# Altium schematic sheet Sheet1.SchDoc: =GlobalProjectName
size 410 x 297 mm; ApprovedBy: Утвердил; CheckedBy: Проверил; Author: Разработал; SheetNumber: Лист; SheetTotal: Листов; PageSetup: Record=PageOptions|CenterHorizontal=True|CenterVertical=True|PrintScale=1.00|XCorrection=1.00|YCorrection=1.00|PrintKind=1|BorderSize=5000000|LeftOffset=0|BottomOffset=0|Orientation=2|PaperLength=1000|PaperWidth=1000|Scale=100|PaperSource=15|PrintQuality=1200|MediaType=1|DitherType=10|PaperKind=A3|PrintScaleMode=1; Weight: -; ScaleFactor: -; NormInspection: Норм.Контр.
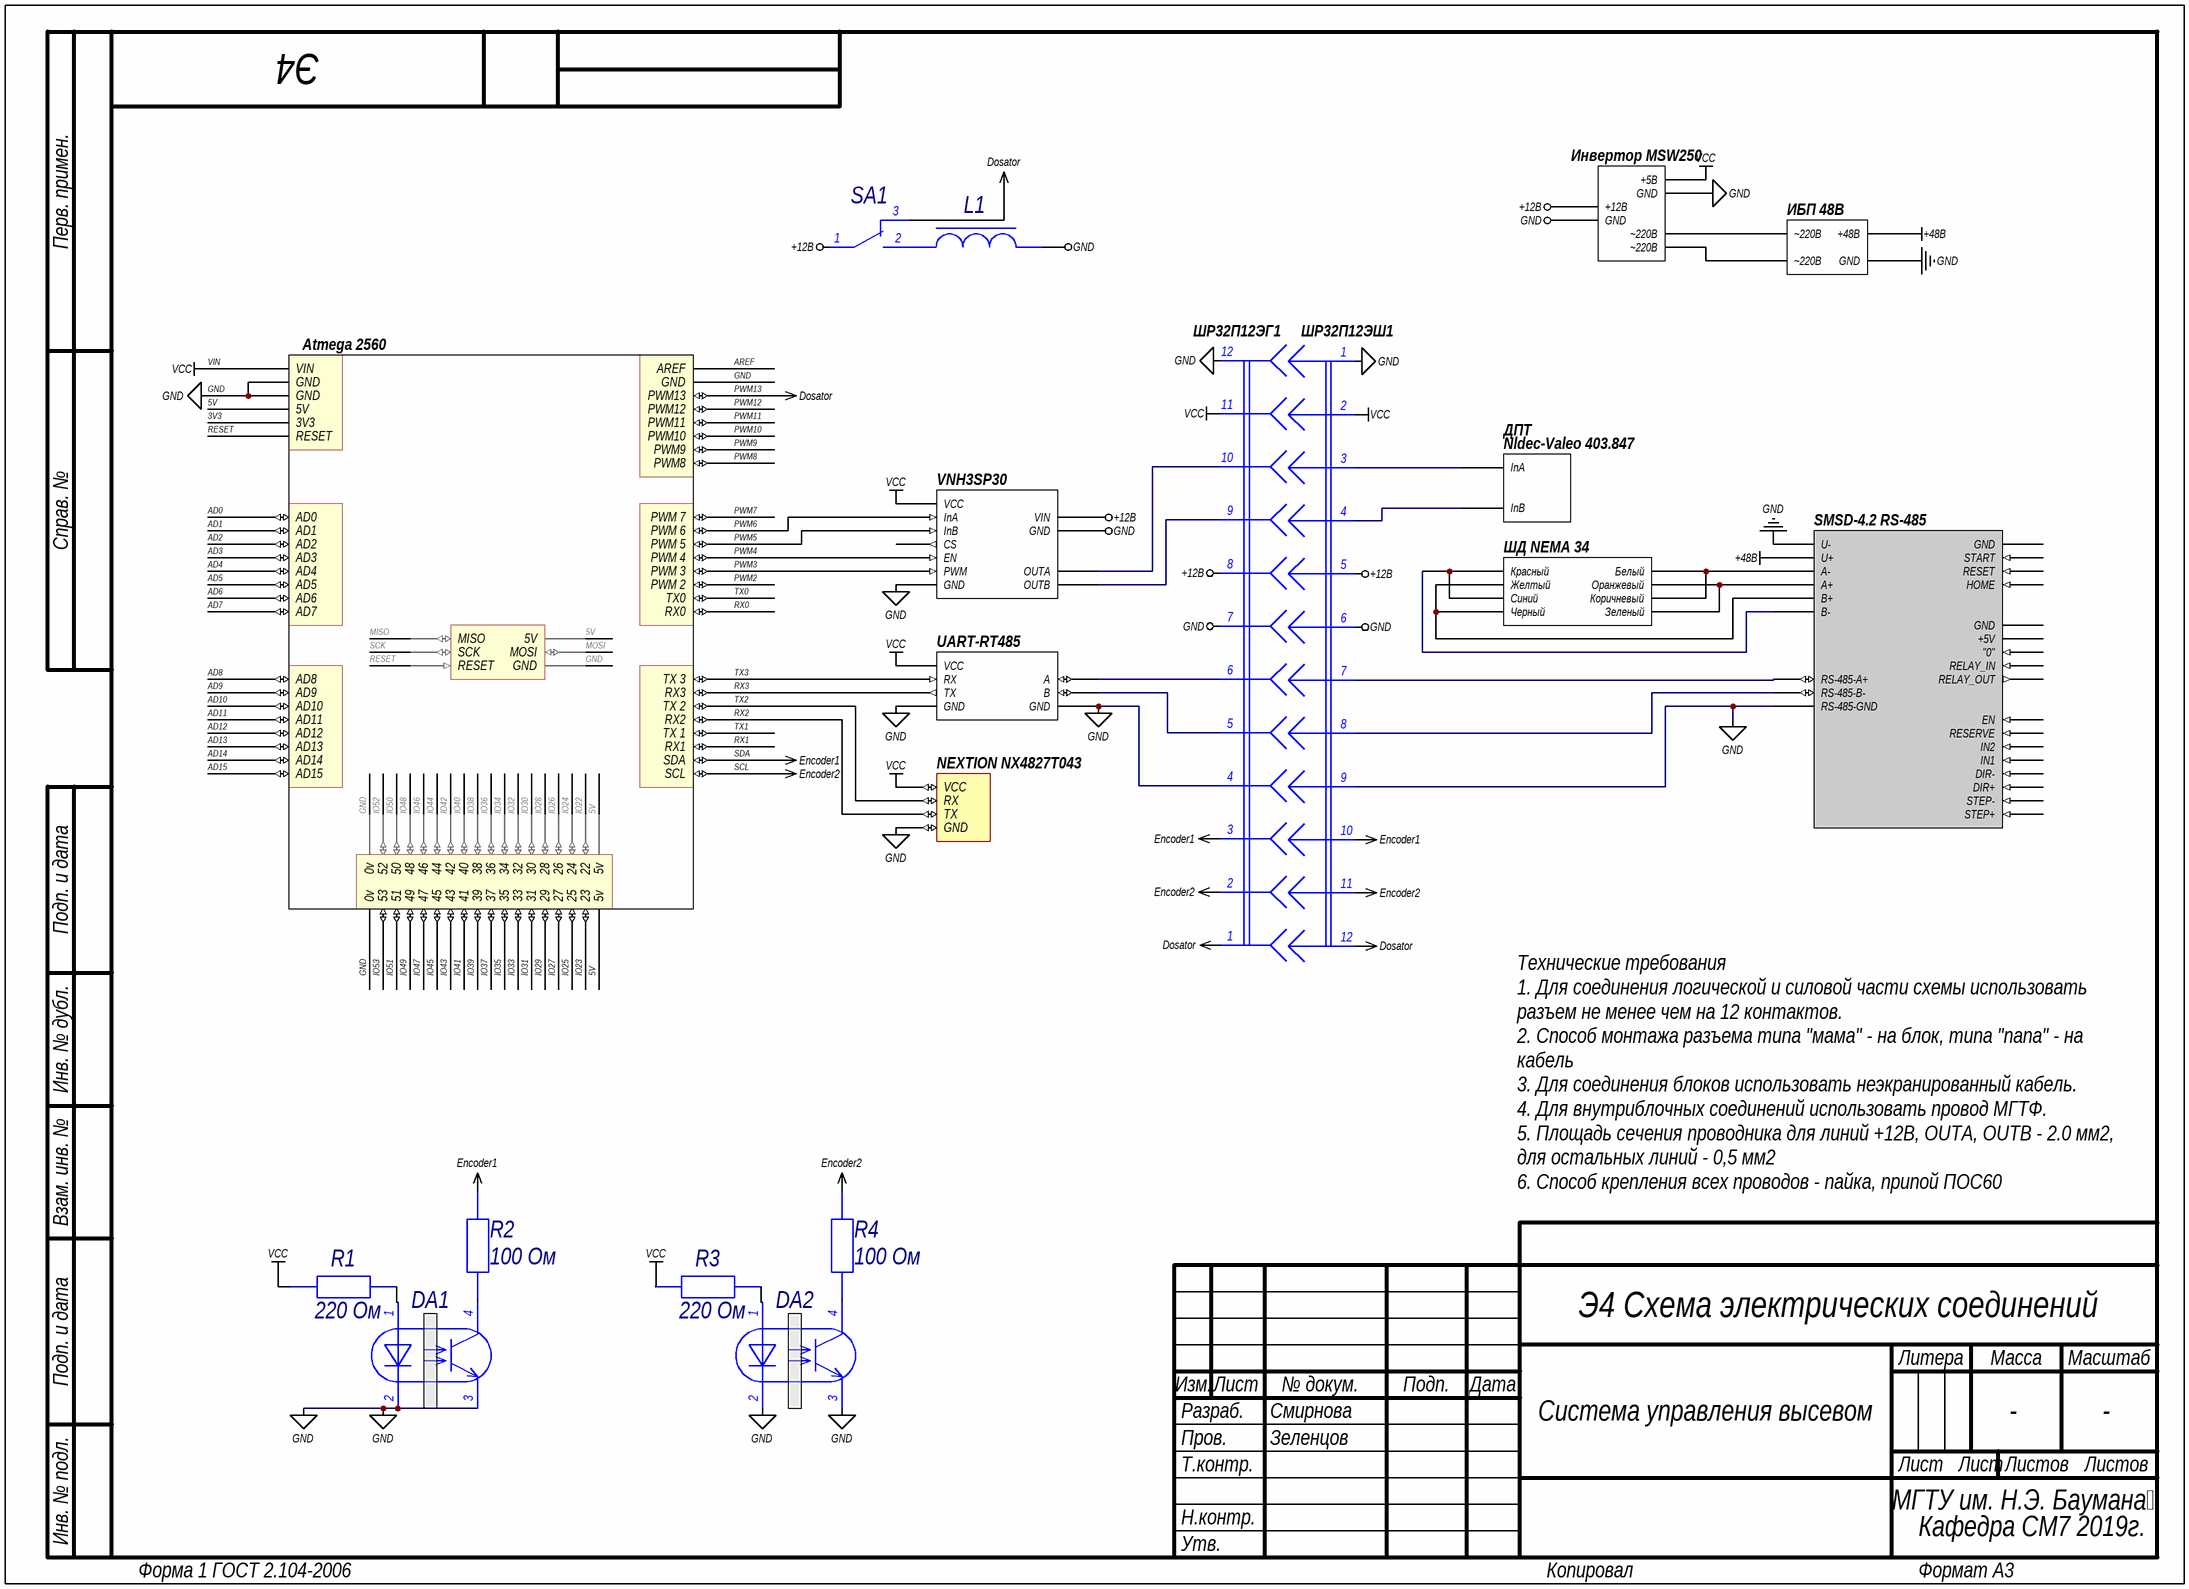
[diagram p0: Sheet1.SchDoc]

## Parts
12В  DPT  [Header 6x1 8.5mm]  (value not drawn)
AD_H1  AD_H  [Header 8x1 8.5mm]  (value not drawn)
AD_L1  AD_L  [Header 8x1 8.5mm]  (value not drawn)
COMMS1  Communication  [Header 8x1 8.5mm]  (value not drawn)
DA1  (no value)
DA2  (no value)
DIGITAL1  IO_36  [HEADER 36X 8MM]  (value not drawn)
DPT?  DPT  [Header 6x1 8.5mm]  (value not drawn)
ICSP1  ICSP  [ICSP]  (value not drawn)
L1  (no value)
NEMA_34  NEMA 34  [Header 6x1 8.5mm]  (value not drawn)
NEXTION  UART  [Header 6x1 8.5mm]  (value not drawn)
OWER1  POWER  [Header 6x1 8.5mm]  (value not drawn)
PowerS  Power  [Header 6x1 8.5mm]  (value not drawn)
PWM_H1  PWM_H  [Header 8x1 8.5mm]  (value not drawn)
PWM_L1  PWM_L  [Header 8x1 8.5mm]  (value not drawn)
R1  220 Ом
R2  100 Ом
R3  220 Ом
R4  100 Ом
SA1  (no value)
SMSD-4.2_RS-485  SMSD-4.2 RS-485  [Header 6x1 8.5mm]  (value not drawn)
UART-RS485  UART-RS485  [Header 6x1 8.5mm]  (value not drawn)
VNH3SP30  VNH3SP30  [Header 6x1 8.5mm]  (value not drawn)
XP?  Text  (value not drawn)
XS?  Text  (value not drawn)

## Blocks framed on the sheet
Atmega 2560: AD_H1 AD_L1 DIGITAL1 ICSP1 OWER1

## Nets
+12B: 12В.1(+12В) SA1.1(A1) VNH3SP30.3(VIN) XP?.5 XS?.8
+48B: PowerS.+48В SMSD-4.2_RS-485.2(U+)
GND: 12В.1(GND) 12В.InB(GND) DA1.2(CК) DA1.3(Э) DA2.2(CК) DA2.3(Э) DIGITAL1.35(0v) DIGITAL1.36(0v) ICSP1.6(GND) L1.2 NEXTION.4(GND) OWER1.2(GND) OWER1.3(GND) PowerS.1(GND) PWM_H1.7(GND) SMSD-4.2_RS-485.1(U-) SMSD-4.2_RS-485.6(RS-485-GND) UART-RS485.1(GND) UART-RS485.4(GND) VNH3SP30.2(GND) VNH3SP30.4(GND) XP?.1 XP?.6 XP?.9 XS?.4 XS?.7 XS?.12
PWM13: PWM_H1.6(PWM13) SA1.3(C1) XP?.12  [also labelled Dosator]
SCL: COMMS1.1(SCL) XP?.11 XS?.2  [also labelled Encoder2]
SDA: COMMS1.2(SDA) XP?.10 XS?.3  [also labelled Encoder1]
VIN: 12В.+5В NEXTION.1(VCC) OWER1.1(VIN) R1.1 R3.1 UART-RS485.1(VCC) VNH3SP30.1(VCC) XP?.2 XS?.11  [also labelled VCC]
3V3: OWER1.5(3V3)
5V: DIGITAL1.1(5v) DIGITAL1.2(5v) ICSP1.2(5V) OWER1.4(5V)
AD0: AD_L1.1(AD0)
AD1: AD_L1.2(AD1)
AD2: AD_L1.3(AD2)
AD3: AD_L1.4(AD3)
AD4: AD_L1.5(AD4)
AD5: AD_L1.6(AD5)
AD6: AD_L1.7(AD6)
AD7: AD_L1.8(AD7)
AD8: AD_H1.1(AD8)
AD9: AD_H1.2(AD9)
AD10: AD_H1.3(AD10)
AD11: AD_H1.4(AD11)
AD12: AD_H1.5(AD12)
AD13: AD_H1.6(AD13)
AD14: AD_H1.7(AD14)
AD15: AD_H1.8(AD15)
AREF: PWM_H1.8(AREF)
IO22: DIGITAL1.3(22)
IO23: DIGITAL1.4(23)
IO24: DIGITAL1.5(24)
IO25: DIGITAL1.6(25)
IO26: DIGITAL1.7(26)
IO27: DIGITAL1.8(27)
IO28: DIGITAL1.9(28)
IO29: DIGITAL1.10(29)
IO30: DIGITAL1.11(30)
IO31: DIGITAL1.12(31)
IO32: DIGITAL1.13(32)
IO33: DIGITAL1.14(33)
IO34: DIGITAL1.15(34)
IO35: DIGITAL1.16(35)
IO36: DIGITAL1.17(36)
IO37: DIGITAL1.18(37)
IO38: DIGITAL1.19(38)
IO39: DIGITAL1.20(39)
IO40: DIGITAL1.21(40)
IO41: DIGITAL1.22(41)
IO42: DIGITAL1.23(42)
IO43: DIGITAL1.24(43)
IO44: DIGITAL1.25(44)
IO45: DIGITAL1.26(45)
IO46: DIGITAL1.27(46)
IO47: DIGITAL1.28(47)
IO48: DIGITAL1.29(48)
IO49: DIGITAL1.30(49)
IO50: DIGITAL1.31(50)
IO51: DIGITAL1.32(51)
IO52: DIGITAL1.33(52)
IO53: DIGITAL1.34(53)
MISO: ICSP1.1(MISO)
MOSI: ICSP1.4(MOSI)
PWM2: PWM_L1.3(PWM_2)
PWM3: PWM_L1.4(PWM_3) VNH3SP30.4(PWM)
PWM4: PWM_L1.5(PWM_4) VNH3SP30.4(EN)
PWM5: PWM_L1.6(PWM_5) VNH3SP30.3(InB)
PWM6: PWM_L1.7(PWM_6) VNH3SP30.2(InA)
PWM7: PWM_L1.8(PWM_7)
PWM8: PWM_H1.1(PWM8)
PWM9: PWM_H1.2(PWM9)
PWM10: PWM_H1.3(PWM10)
PWM11: PWM_H1.4(PWM11)
PWM12: PWM_H1.5(PWM12)
RESET: ICSP1.5(RESET) OWER1.6(RESET)
RX0: PWM_L1.1(RX0)
RX1: COMMS1.3(RX1)
RX2: COMMS1.5(RX2) NEXTION.3(TX)
RX3: COMMS1.7(RX3) UART-RS485.3(TX)
SCK: ICSP1.3(SCK)
TX0: PWM_L1.2(TX0)
TX1: COMMS1.4(TX_1)
TX2: COMMS1.6(TX_2) NEXTION.2(RX)
TX3: COMMS1.8(TX_3) UART-RS485.2(RX)
Net12В_1: 12В.1(~220В) PowerS.+5В(~220В)
Net12В_+5В: 12В.+5В(~220В) PowerS.1(~220В)
NetDA1_1: DA1.1(CА) R1.2
NetDA1_4: DA1.4(К) R2.1
NetDA2_1: DA2.1(CА) R3.2
NetDA2_4: DA2.4(К) R4.1
NetDPT?_1: DPT?.1(InA) XP?.3
NetDPT?_InB: DPT?.InB XP?.4
NetL1_1: L1.1 SA1.2(B1)
NetNEMA_34_1: NEMA_34.1(Коричневый) NEMA_34.Белый SMSD-4.2_RS-485.3(A-)
NetNEMA_34_1: NEMA_34.1(Зеленый) SMSD-4.2_RS-485.4(A+)  [a separate net that carries the same name]
NetNEMA_34_1: NEMA_34.1(Желтый) NEMA_34.Черный SMSD-4.2_RS-485.5(B+)  [a separate net that carries the same name]
NetNEMA_34_1: NEMA_34.1(Красный) SMSD-4.2_RS-485.6(B-)  [a separate net that carries the same name]
NetSMSD-4.2_RS-485_4: SMSD-4.2_RS-485.4(RS-485-A+) XP?.7
NetSMSD-4.2_RS-485_5: SMSD-4.2_RS-485.5(RS-485-B-) XP?.8
NetUART-RS485_2: UART-RS485.2(B) XS?.5
NetUART-RS485_3: UART-RS485.3(A) XS?.6
NetVNH3SP30_1: VNH3SP30.1(OUTA) XS?.10
NetVNH3SP30_1: VNH3SP30.1(OUTB) XS?.9  [a separate net that carries the same name]

Not connected (* = marked no-connect by the designer): R2 2; R4 2; XS? 1

## Notes on the sheet
- (near 12В) Инвертор MSW250
- (near PowerS) ИБП 48В
- (near XS?) ШР32П12ЭГ1
- (near XP?) ШР32П12ЭШ1
- (near DPT?) Nldec-Valeo 403.847
- (near DPT?) ДПТ
- (near VNH3SP30) VNH3SP30
- (near SMSD-4.2_RS-485) SMSD-4.2 RS-485
- (near NEMA_34) ШД NEMA 34
- (near UART-RS485) UART-RT485
- (near NEXTION) NEXTION NX4827T043
- Технические требования
  1. Для соединения логической и силовой части схемы использовать разъем не менее чем на 12 контактов.
  2. Способ монтажа разъема типа "мама" - на блок, типа "папа" - на кабель
  3. Для соединения блоков использовать неэкранированный кабель.
  4. Для внутриблочных соединений использовать провод МГТФ.
  5. Площадь сечения проводника для линий +12В, OUTA, OUTB - 2.0 мм2, для остальных линий - 0,5 мм2
  6. Способ крепления всех проводов - пайка, припой ПОС60
- Labels drawn without touching a wire or pin: Dosator, Encoder1, Encoder2
- Э4
- Перв. примен.
- Справ. №
- Подп. и дата
- Инв. № дубл.
- Взам. инв. №
- Э4 Схема электрических соединений
- Разраб.
- Изм.
- Лист
- Смирнова
- № докум.
- Подп.
- Дата
- Система управления высевом
- Литера
- Масса
- Масштаб
- Пров.
- Т.контр.
- Зеленцов
- Листов
- Инв. № подл.
- Н.контр.
- Утв.
- МГТУ им. Н.Э. Баумана
- Кафедра СМ7 2019г.
- Форма 1 ГОСТ 2.104-2006
- Копировал
- Формат А3

## Library data of the parts
12В = Battery: Supplier 1: Arrow; Supplier 2: Arrow; Supplier 3: Digi-Key; Supplier 4: Newark; Supplier Part Number 3: SAM1198-06-ND
DA1 DA2 = Photocoupler-4p: Published: 09.01.2017; Publisher: Andrew Danich; Type: Микросхема
L1 = Coil: Type: Дроссель; Published: 20.05.2010; Publisher: Andrew Danich
PowerS = PowerS: Supplier 1: Arrow; Supplier 2: Arrow; Supplier 3: Digi-Key; Supplier 4: Newark; Supplier Part Number 3: SAM1198-06-ND
R1-R4 = Resistor: Published: 24.03.2010; Publisher: Andrew Danich; Type: Резистор
SA1 = SW-01x-02p: Published: 17.04.2014; Publisher: Andrew Danich; Type: Переключатель
XP? = Con-12-M: Value: Connector; Published: 07.03.2013; Publisher: Andrew Danich; Type: Вилка
XS? = Con-12-F: Value: Connector; Published: 07.03.2013; Publisher: Andrew Danich; Type: Розетка
AD_H1 = AD_H: Supplier 1: Arrow; Supplier 2: Digi-Key; Supplier 3: Newark; Supplier 4: Arrow; Supplier Part Number 1: 2698925; Supplier Part Number 2: SAM1198-08-ND; Supplier Part Number 3: 11P8329; Supplier Part Number 4: 2698940
AD_L1 = AD_L: Supplier 1: Arrow; Supplier 2: Arrow; Supplier 3: Newark; Supplier 4: Digi-Key; Supplier Part Number 1: 2698925; Supplier Part Number 2: 2698940; Supplier Part Number 3: 11P8329; Supplier Part Number 4: SAM1198-08-ND
COMMS1 = Communication: Supplier 1: Arrow; Supplier 2: Digi-Key; Supplier 3: Arrow; Supplier Part Number 1: 2698925; Supplier Part Number 2: SAM1198-08-ND; Supplier Part Number 3: 2698940
DIGITAL1 = IO_36: Supplier 1: Arrow; Supplier 2: Digi-Key; Supplier 3: Arrow; Supplier Part Number 1: 2697470; Supplier Part Number 2: SAM1198-36-ND; Supplier Part Number 3: 2697486
DPT? = DPT: Supplier 1: Arrow; Supplier 2: Arrow; Supplier 3: Digi-Key; Supplier 4: Newark; Supplier Part Number 3: SAM1198-06-ND
ICSP1 = ICSP: Supplier 1: Digi-Key; Supplier 2: Arrow; Supplier 3: Arrow; Supplier Part Number 1: SAM1185-03-ND; Supplier Part Number 2: 2699340; Supplier Part Number 3: 46091550
NEMA_34 = NEMA 34: Supplier 1: Arrow; Supplier 2: Arrow; Supplier 3: Digi-Key; Supplier 4: Newark; Supplier Part Number 3: SAM1198-06-ND
NEXTION = UART: Supplier 1: Arrow; Supplier 2: Arrow; Supplier 3: Digi-Key; Supplier 4: Newark
OWER1 = POWER: Supplier 1: Arrow; Supplier 2: Arrow; Supplier 3: Newark; Supplier 4: Digi-Key; Supplier Part Number 1: 2699075; Supplier Part Number 2: 2699089; Supplier Part Number 3: 11P8269; Supplier Part Number 4: SAM1198-06-ND
PWM_H1 = PWM_H: Supplier 1: Arrow; Supplier 2: Arrow; Supplier 3: Digi-Key; Supplier Part Number 1: 2698925; Supplier Part Number 2: 2698940; Supplier Part Number 3: SAM1198-08-ND
PWM_L1 = PWM_L: Supplier 1: Arrow; Supplier 2: Arrow; Supplier 3: Digi-Key; Supplier Part Number 1: 2698925; Supplier Part Number 2: 2698940; Supplier Part Number 3: SAM1198-08-ND
SMSD-4.2_RS-485 = SMSD-4.2 RS-485: Supplier 1: Arrow; Supplier 2: Arrow; Supplier 3: Digi-Key; Supplier 4: Newark; Supplier Part Number 3: SAM1198-06-ND
UART-RS485 = UART-RS485: Supplier 1: Arrow; Supplier 2: Arrow; Supplier 3: Digi-Key; Supplier 4: Newark; Supplier Part Number 3: SAM1198-06-ND
VNH3SP30 = VNH3SP30: Supplier 1: Arrow; Supplier 2: Arrow; Supplier 3: Digi-Key; Supplier 4: Newark; Supplier Part Number 3: SAM1198-06-ND